# EAGLE schematic pcd_DRAW (EAGLE 9.3.2)
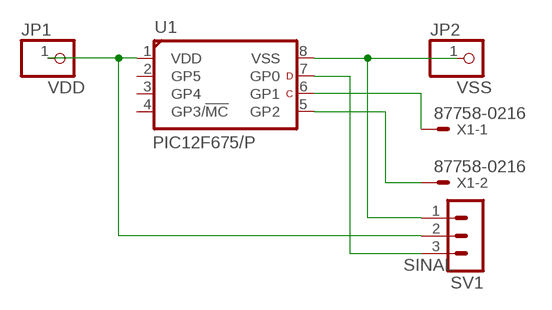
[diagram p0: schematic, sheet 1]

## Parts
JP1  PINHD-1X1  [1X01]
JP2  PINHD-1X1  [1X01]
SV1  MA03-1  [MA03-1]
U1  PIC12F675/P  [DIL8-P]
X1  87758-0216  [87758-0216]

## Nets
N$1: U1.6(GP1) X1.1
N$2: U1.5(GP2) X1.2
SINAL: SV1.3 U1.7(GP0)
VDD: JP1.1 SV1.2 U1.1(VDD)
VSS: JP2.1 SV1.1 U1.8(VSS)
Unconnected: U1.2(GP5) U1.3(GP4) U1.4(GP3/!MC!)

## Library data of the parts
JP1 JP2 = pinhead:PINHD-1X1: PIN HEADER
SV1 = con-lstb:MA03-1: PIN HEADER; OC_FARNELL: unknown; OC_NEWARK: unknown
U1 = microchip_pic12f:PIC12F675: Low pincount microcontroller http://www.microchip.com/wwwproducts/Devices.aspx?product=PIC12F675 Properties Parameter Name Value Program Memory Type Flash Program Memory (KB) 1.75 CPU Speed (MIPS) 5 RAM Bytes 64 Data EEPROM (bytes) 128 Timers 1 x 8-bit, 1 x 16-bit ADC 4 ch, 10-bit Comparators 1 Temperature Range (C) -40 to 125 Operating Voltage Range (V) 2 to 5.5 Pin Count 8 Cap Touch Channels 4 Features 128 bytes of EEPROM data memory, Programmable pull-up resistors, MPLAB® ICD-2 programming support or debugging support with optional header adapter, 4 oscillator selections including 4 MHz RC oscillator with programmable calibration and Power-On Reset. Library from www.mikroelektroniikka.fi/lbr
X1 = con-molex:87758-0216: 2 Pin - 2mm Dual Row Single Wafer, Vertical T/H HDR Source: http://www.molex.com/pdm_docs/sd/877580616_sd.pdf; MF: MOLEX; MPN: 87758-0216; OC_FARNELL: unknown; OC_NEWARK: 94M1513